# Altium schematic sheet 23005_4.SchDoc: Classic Computer IO Platform
size A3; Date: 06/11/2018; CompanyName: Heber Ltd; Organization: Heber Limited; DocumentNumber: 56-23005; Revision: 3; SheetNumber: 4; SheetTotal: 6
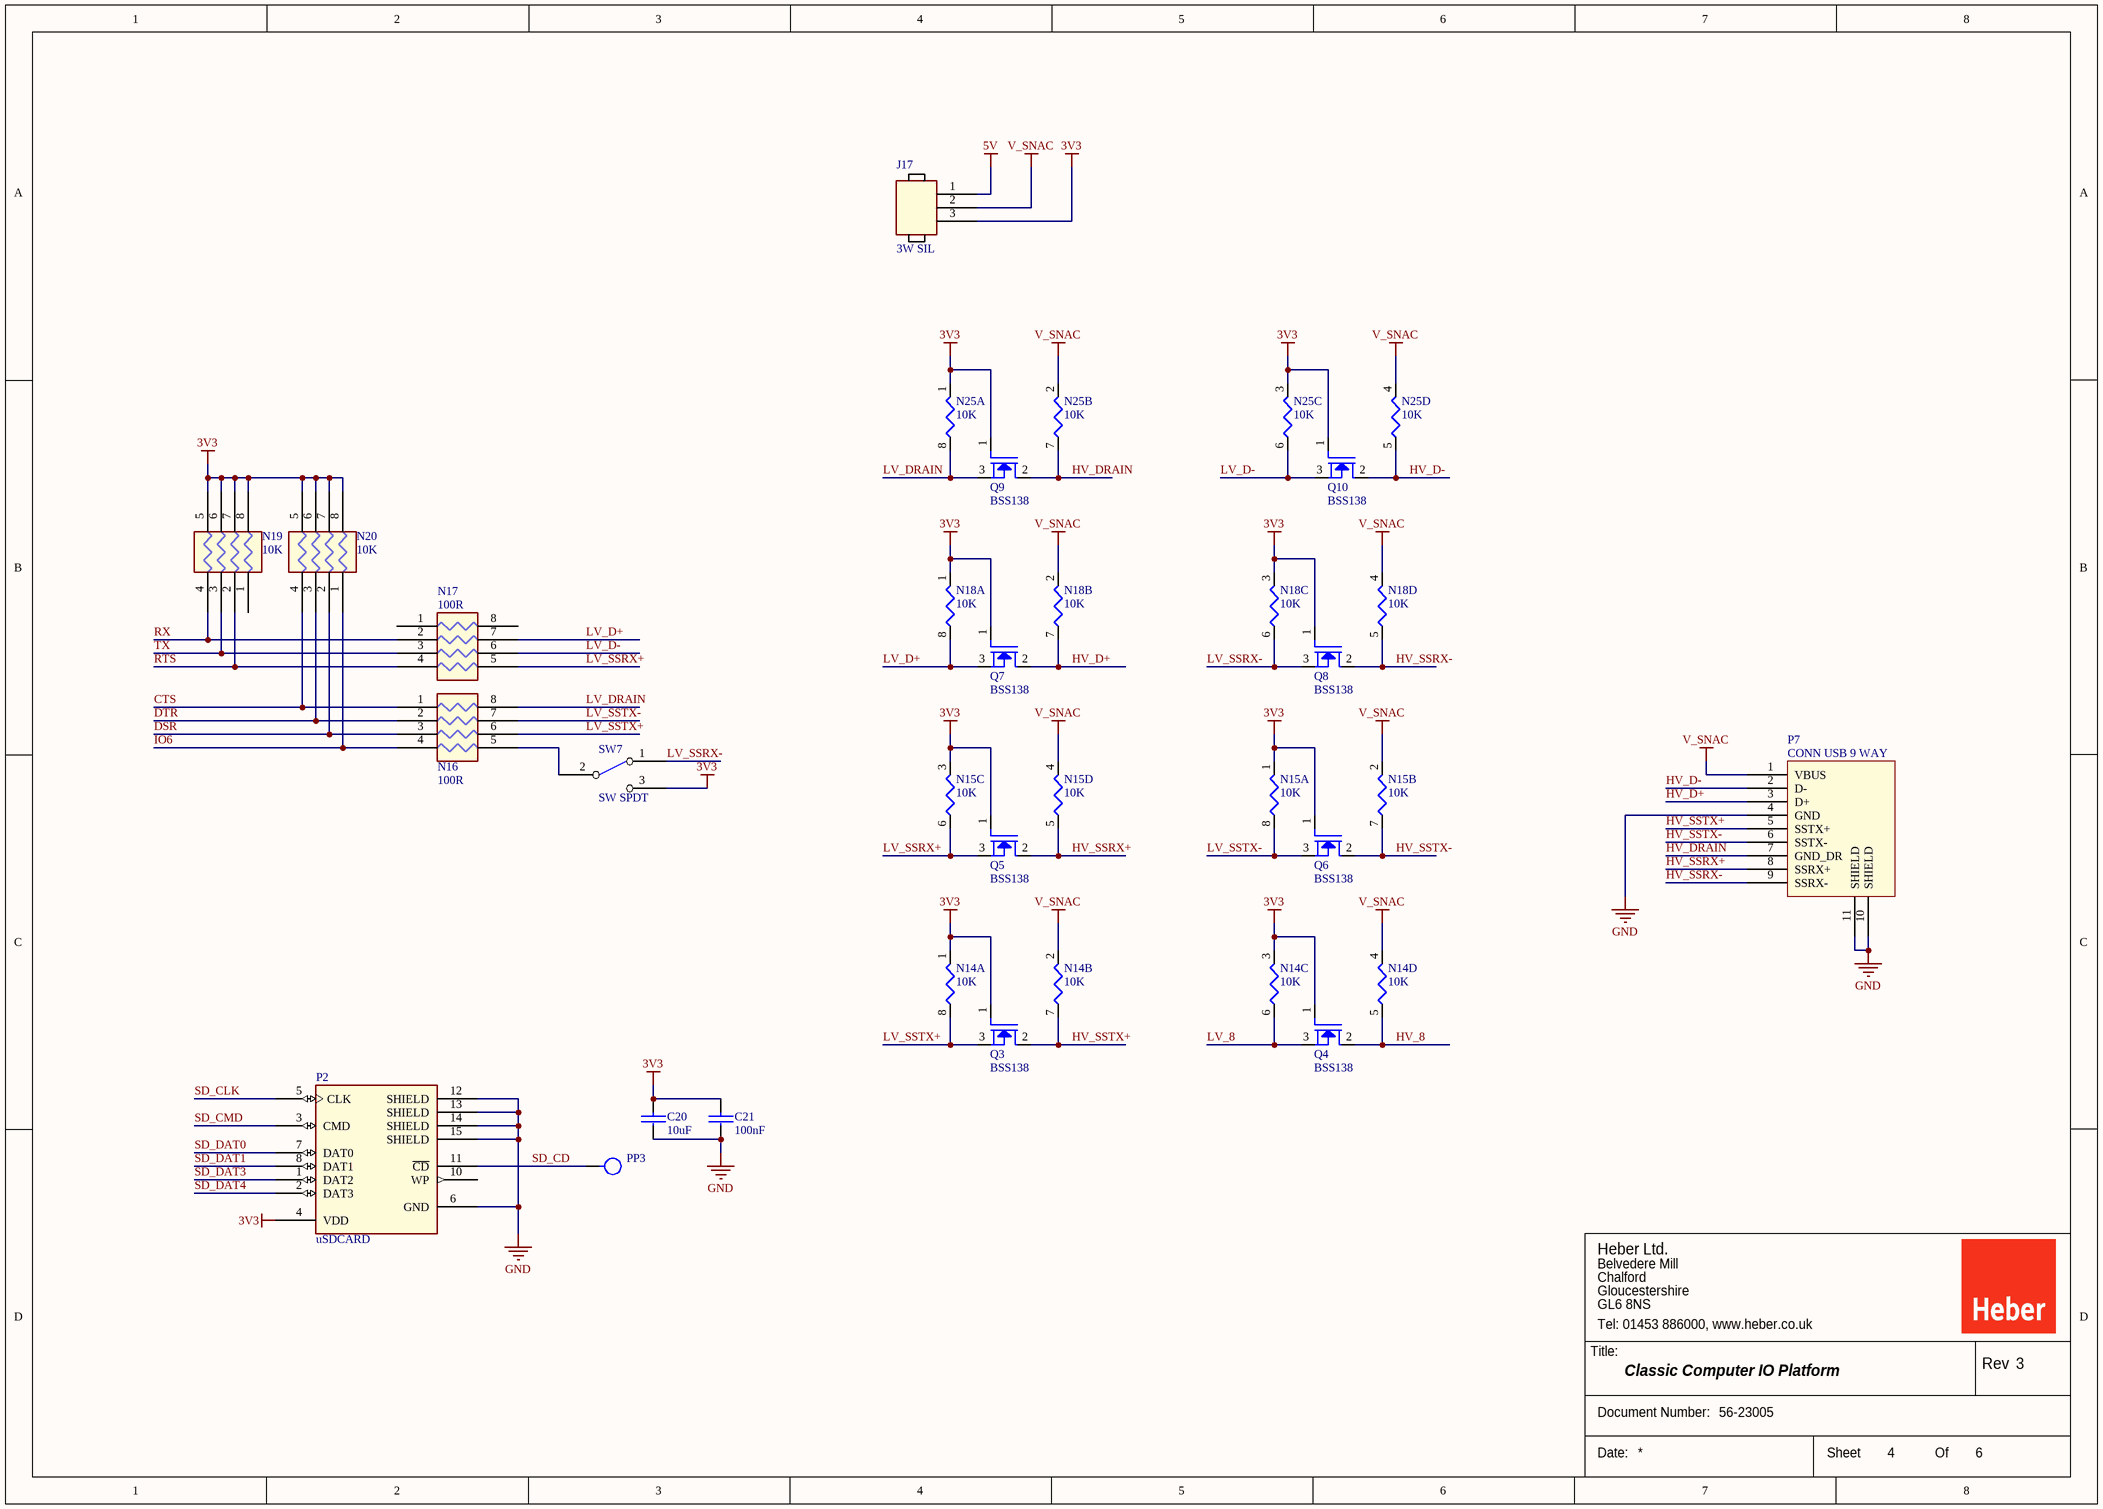
[diagram p0: 23005_4.SchDoc]

## Parts
C20  10uF  [SM0805]
C21  100nF  [SM0603]
J17  3W SIL  [3WSIL]
N14  10K  [1206RES4_I2]  (parts A,B,C,D of 4)
N15  10K  [1206RES4_I2]  (parts A,B,C,D of 4)
N16  100R  [1206RES4_I2]
N17  100R  [1206RES4_I2]
N18  10K  [1206RES4_I2]  (parts A,B,C,D of 4)
N19  10K  [1206RES4_I2]
N20  10K  [1206RES4_I2]
N25  10K  [1206RES4_I2]  (parts A,B,C,D of 4)
P2  uSDCARD  [AMP_114-00841-68]
P7  CONN USB 9 WAY  [WURTH_692121030100]
PP3  PROBEPOINT_SHORT  [PROBEPOINT]  (value not drawn)
Q3  BSS138  [SOT23]
Q4  BSS138  [SOT23]
Q5  BSS138  [SOT23]
Q6  BSS138  [SOT23]
Q7  BSS138  [SOT23]
Q8  BSS138  [SOT23]
Q9  BSS138  [SOT23]
Q10  BSS138  [SOT23]
SW7  SW SPDT  [SW_ITT_OS102011MS2QN1]

## Nets
3V3: C20.1 C21.1 J17.3 N14.1 N14.3 N15.1 N15.3 N18.1 N18.3 N19.5 N19.6 N19.7 N19.8 N20.5 N20.6 N20.7 N20.8 N25.1 N25.3 P2.4(VDD) Q3.1(GATE) Q4.1(GATE) Q5.1(GATE) Q6.1(GATE) Q7.1(GATE) Q8.1(GATE) Q9.1(GATE) Q10.1(GATE) SW7.3(NO)
5V: J17.1
GND: C20.2 C21.2 P2.6(GND) P2.12(SHIELD) P2.13(SHIELD) P2.14(SHIELD) P2.15(SHIELD) P7.4(GND) P7.10(SHIELD) P7.11(SHIELD)
V_SNAC: J17.2 N14.2 N14.4 N15.2 N15.4 N18.2 N18.4 N25.2 N25.4 P7.1(VBUS)
CTS: N16.1 N20.4
DSR: N16.3 N20.2
DTR: N16.2 N20.3
HV_8: N14.5 Q4.2(DRAIN)
HV_D+: N18.7 P7.3(D+) Q7.2(DRAIN)
HV_D-: N25.5 P7.2(D-) Q10.2(DRAIN)
HV_DRAIN: N25.7 P7.7(GND_DR) Q9.2(DRAIN)
HV_SSRX+: N15.5 P7.8(SSRX+) Q5.2(DRAIN)
HV_SSRX-: N18.5 P7.9(SSRX-) Q8.2(DRAIN)
HV_SSTX+: N14.7 P7.5(SSTX+) Q3.2(DRAIN)
HV_SSTX-: N15.7 P7.6(SSTX-) Q6.2(DRAIN)
IO6: N16.4 N20.1
LV_8: N14.6 Q4.3(SOURCE)
LV_D+: N17.7 N18.8 Q7.3(SOURCE)
LV_D-: N17.6 N25.6 Q10.3(SOURCE)
LV_DRAIN: N16.8 N25.8 Q9.3(SOURCE)
LV_SSRX+: N15.6 N17.5 Q5.3(SOURCE)
LV_SSRX-: N18.6 Q8.3(SOURCE) SW7.1(NC)
LV_SSTX+: N14.8 N16.6 Q3.3(SOURCE)
LV_SSTX-: N15.8 N16.7 Q6.3(SOURCE)
RTS: N17.4 N19.2
RX: N17.2 N19.4
SD_CD: P2.11(~{CD}) PP3.1
SD_CLK: P2.5(CLK)
SD_CMD: P2.3(CMD)
SD_DAT0: P2.7(DAT0)
SD_DAT1: P2.8(DAT1)
SD_DAT3: P2.1(DAT2)
SD_DAT4: P2.2(DAT3)
TX: N17.3 N19.3
NetN16_5: N16.5 SW7.2(COMMON)

Not connected (* = marked no-connect by the designer): N17 1 8; N19 1; P2 10(WP)

## Notes on the sheet
- Heber Ltd.
- Belvedere Mill
- Chalford
- GL6 8NS
- Gloucestershire
- Tel: 01453 886000, www.heber.co.uk
- Title:
- Rev
- Document Number:
- Date:
- Sheet
- Of

## Library data of the parts
C20 C21 = C
J17 = HEADER 3
N14 N15 N18 N25 = RESISTOR DIP 4 A-D
N16 N17 N19 N20 = RESISTOR DIP 4
Q3-Q10 = MOSFET N_0